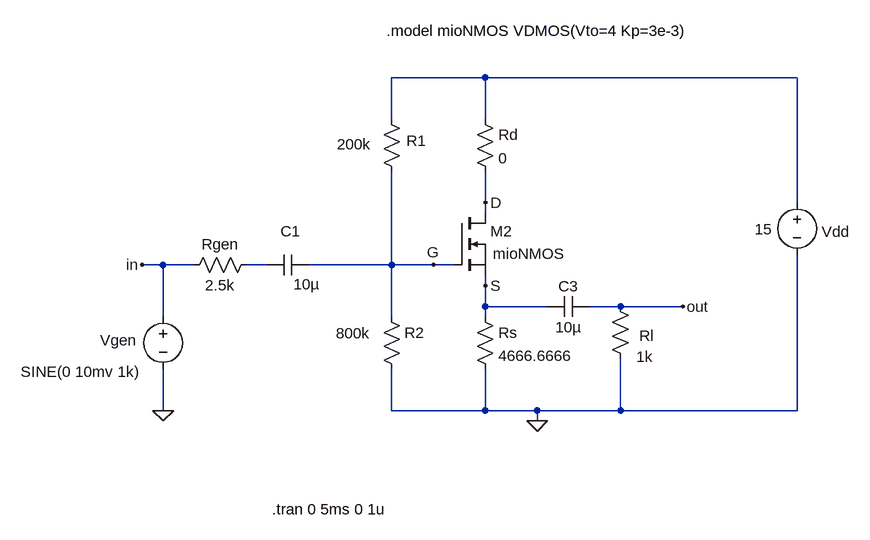
[diagram p0: schematic tesina_ampliMOS-CD.asc]
tesina_ampliMOS-CD.asc, the LTspice schematic file:
Version 4
SHEET 1 988 692
WIRE -98096 -70096 -98240 -70096
WIRE -97616 -70096 -98096 -70096
WIRE -98240 -70032 -98240 -70096
WIRE -98096 -70032 -98096 -70096
WIRE -98096 -69904 -98096 -69952
WIRE -97616 -69904 -97616 -70096
WIRE -98096 -69888 -98096 -69904
WIRE -98592 -69808 -98624 -69808
WIRE -98544 -69808 -98592 -69808
WIRE -98432 -69808 -98464 -69808
WIRE -98240 -69808 -98240 -69952
WIRE -98240 -69808 -98368 -69808
WIRE -98176 -69808 -98240 -69808
WIRE -98144 -69808 -98176 -69808
WIRE -98096 -69776 -98096 -69792
WIRE -98096 -69744 -98096 -69776
WIRE -98000 -69744 -98096 -69744
WIRE -97888 -69744 -97936 -69744
WIRE -97792 -69744 -97888 -69744
WIRE -98592 -69728 -98592 -69808
WIRE -98240 -69728 -98240 -69808
WIRE -98096 -69728 -98096 -69744
WIRE -98592 -69584 -98592 -69648
WIRE -98240 -69584 -98240 -69648
WIRE -98096 -69584 -98096 -69648
WIRE -98096 -69584 -98240 -69584
WIRE -98016 -69584 -98096 -69584
WIRE -97888 -69584 -97888 -69664
WIRE -97888 -69584 -98016 -69584
WIRE -97616 -69584 -97616 -69824
WIRE -97616 -69584 -97888 -69584
WIRE -98016 -69568 -98016 -69584
FLAG -98176 -69808 G
FLAG -98096 -69904 D
FLAG -98592 -69584 0
FLAG -98016 -69568 0
FLAG -98096 -69776 S
FLAG -98624 -69808 in
FLAG -97792 -69744 out
SYMBOL nmos -98144 -69888 R0
WINDOW 3 60 63 Left 2
WINDOW 0 56 28 Left 2
SYMATTR Value mioNMOS
SYMATTR InstName M2
SYMBOL res -98112 -70048 R0
SYMATTR InstName Rd
SYMATTR Value 0
SYMBOL res -98112 -69744 R0
SYMATTR InstName Rs
SYMATTR Value 4666.6666
SYMBOL res -98256 -70048 R0
WINDOW 3 -68 54 Left 2
WINDOW 0 39 49 Left 2
SYMATTR Value 200k
SYMATTR InstName R1
SYMBOL voltage -97616 -69920 R0
WINDOW 0 38 61 Left 2
WINDOW 3 -65 57 Left 2
WINDOW 123 0 0 Left 2
WINDOW 39 0 0 Left 2
SYMATTR InstName Vdd
SYMATTR Value 15
SYMBOL cap -98368 -69824 R90
WINDOW 0 -20 28 VBottom 2
WINDOW 3 30 3 VTop 2
SYMATTR InstName C1
SYMATTR Value 10µ
SYMBOL res -98256 -69744 R0
WINDOW 3 -70 41 Left 2
SYMATTR Value 800k
SYMATTR InstName R2
SYMBOL voltage -98592 -69744 R0
WINDOW 0 -97 52 Left 2
WINDOW 3 -219 100 Left 2
SYMATTR InstName Vgen
SYMATTR Value SINE(0 10mv 1k)
SYMBOL res -98448 -69824 R90
WINDOW 0 0 56 VBottom 2
WINDOW 3 32 56 VTop 2
SYMATTR InstName Rgen
SYMATTR Value 2.5k
SYMBOL res -97872 -69648 R180
WINDOW 0 -36 51 Left 2
WINDOW 3 -34 19 Left 2
SYMATTR InstName Rl
SYMATTR Value 1k
SYMBOL cap -97936 -69760 R90
WINDOW 0 0 32 VBottom 2
WINDOW 3 32 32 VTop 2
SYMATTR InstName C3
SYMATTR Value 10µ
TEXT -98248 -70168 Left 2 !.model mioNMOS VDMOS(Vto=4 Kp=3e-3)
TEXT -98424 -69432 Left 2 !.tran 0 5ms 0 1u

The netlist it stands for:
* tesina_ampliMOS-CD.asc
M2 D G S S mioNMOS
Rd N001 D 0
Rs S 0 4666.6666
R1 N001 G 200k
Vdd N001 0 15
C1 G N002 10µ
R2 G 0 800k
Vgen in 0 SINE(0 10mv 1k)
Rgen N002 in 2.5k
Rl 0 out 1k
C3 out S 10µ
.model NMOS NMOS
.model PMOS PMOS
.lib standard.mos
.model mioNMOS VDMOS(Vto=4 Kp=3e-3)
.tran 0 5ms 0 1u
.backanno
.end